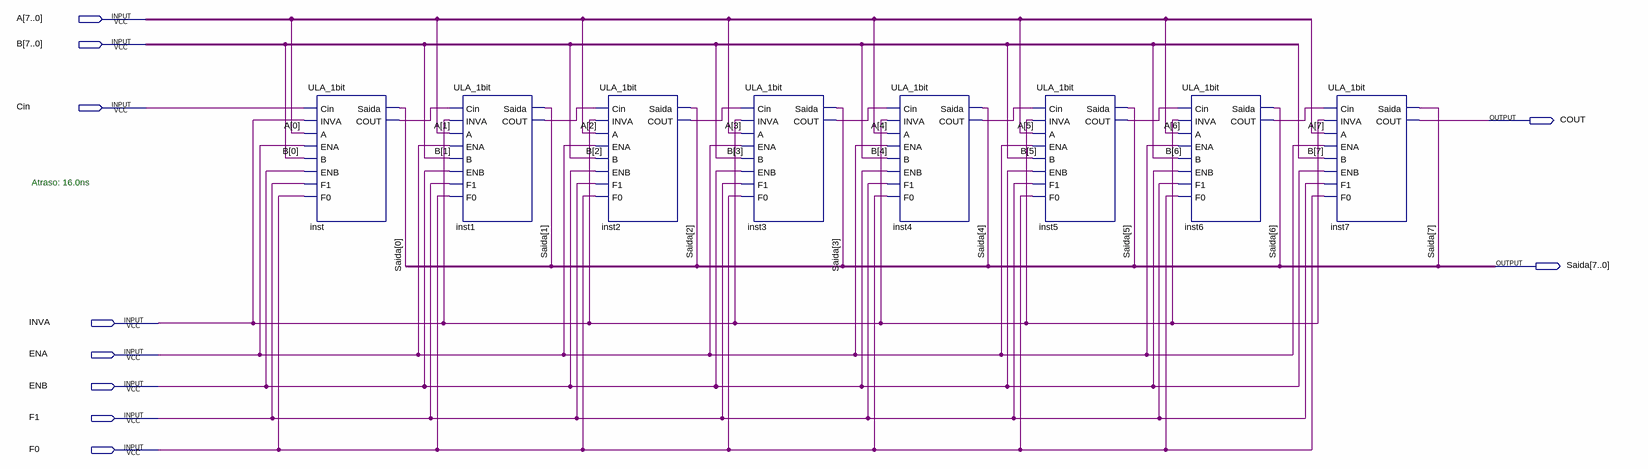
[diagram p0: schematic sheet]
// Quartus schematic ULA_8bits.bdf as structural Verilog: 8 symbols, 10 pins
module ULA_8bits (
  input  [7:0] A,
  input  [7:0] B,
  input  Cin,
  input  INVA,
  input  ENA,
  input  ENB,
  input  F1,
  input  F0,
  output COUT,
  output [7:0] Saida
);

  wire inst1_cout, inst2_cout, inst3_cout, inst4_cout, inst5_cout, inst6_cout, inst_cout;

  ULA_1bit inst (
    .Cin(Cin), .INVA(INVA), .A(A[0]), .ENA(ENA), .B(B[0]), .ENB(ENB), .F1(F1), .F0(F0), .Saida(Saida[0]),
    .COUT(inst_cout));
  ULA_1bit inst1 (
    .Cin(inst_cout), .INVA(INVA), .A(A[1]), .ENA(ENA), .B(B[1]), .ENB(ENB), .F1(F1), .F0(F0),
    .Saida(Saida[1]), .COUT(inst1_cout));
  ULA_1bit inst2 (
    .Cin(inst1_cout), .INVA(INVA), .A(A[2]), .ENA(ENA), .B(B[2]), .ENB(ENB), .F1(F1), .F0(F0),
    .Saida(Saida[2]), .COUT(inst2_cout));
  ULA_1bit inst3 (
    .Cin(inst2_cout), .INVA(INVA), .A(A[3]), .ENA(ENA), .B(B[3]), .ENB(ENB), .F1(F1), .F0(F0),
    .Saida(Saida[3]), .COUT(inst3_cout));
  ULA_1bit inst4 (
    .Cin(inst3_cout), .INVA(INVA), .A(A[4]), .ENA(ENA), .B(B[4]), .ENB(ENB), .F1(F1), .F0(F0),
    .Saida(Saida[4]), .COUT(inst4_cout));
  ULA_1bit inst5 (
    .Cin(inst4_cout), .INVA(INVA), .A(A[5]), .ENA(ENA), .B(B[5]), .ENB(ENB), .F1(F1), .F0(F0),
    .Saida(Saida[5]), .COUT(inst5_cout));
  ULA_1bit inst6 (
    .Cin(inst5_cout), .INVA(INVA), .A(A[6]), .ENA(ENA), .B(B[6]), .ENB(ENB), .F1(F1), .F0(F0),
    .Saida(Saida[6]), .COUT(inst6_cout));
  ULA_1bit inst7 (
    .Cin(inst6_cout), .INVA(INVA), .A(A[7]), .ENA(ENA), .B(B[7]), .ENB(ENB), .F1(F1), .F0(F0),
    .Saida(Saida[7]), .COUT(COUT));

  // Notes on the sheet:
  //   Atraso: 16.0ns
endmodule
